# Altium schematic sheet 74HC4051D,653.schdoc
size 127 x 101 mm
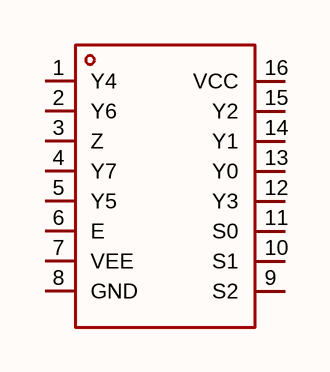
[diagram p0: 74HC4051D,653.schdoc]

## Parts
U?  74hc4051d,653  [SOIC-16_L9.9-W3.9-P1.27-LS6.0-BL]  (value not drawn)

## Nets

Not connected (* = marked no-connect by the designer): U? 1(Y4) 2(Y6) 3(Z) 4(Y7) 5(Y5) 6(E) 7(VEE) 8(GND) 9(S2) 10(S1) 11(S0) 12(Y3) 13(Y0) 14(Y1) 15(Y2) 16(VCC)

## Library data of the parts
U? = 74hc4051d,653: 开关电路:8:1;通道数:1;导通电阻(Ron):80Ω;; Manufacturer: Nexperia(安世); AddInBom: yes; ModelId: c21ec766ec2643efb3352f8441994f4e; ModelName: SOIC-16_L9.9-W3.9-H1.8-LS6.0-P1.27; ModelTransform: 389.763,236.454,0,0,0,0,0,0,0; Switch Circuit: 8:1; Number of Channels: 1; Ron: 80Ω; Voltage - Supply: 2V~10V; Turn-on time: 29ns; Turn-off time: 31ns; Propagation Delay (tpd): 5ns; Symbol: 74HC4051D,653; LCSC Part Name: 8通道模拟多路复用器/解复用器; SupplierPart: C9386; ManufacturerPart: 74HC4051D,653; Supplier Footprint: SOIC-16; JLCPCB Part Class: Extended Part; Datasheet: https://item.szlcsc.com/datasheet/74HC4051D%252C653/9915.html; Supplier: LCSC; ConvertToPcb: yes; FootprintName: SOIC-16_L9.9-W3.9-P1.27-LS6.0-BL; Con: -; Bandwidth: -; Operating Temperature: -40℃~+125℃; Features: 电平转换